# EAGLE design bord (EAGLE 8.5.2)
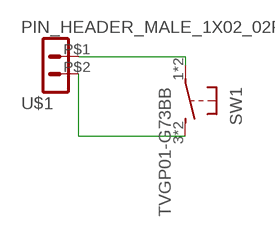
[diagram p0: schematic, sheet 1]

## Parts
SW1  TVGP01-G73BB  [TVGP01-G73BB]
U$1  PIN_HEADER_MALE_1X02_02P  [PIN_HEADER_MALE_1X02_02P]

## Nets
N$1: SW1.1 SW1.2 U$1.P$1
N$2: SW1.3 SW1.4 U$1.P$2

## Library data of the parts
SW1 = new:TVGP01-G73BB: http://akizukidenshi.com/download/ds/jianfu/TVGP01-G73BB.pdf
U$1 = 180118 Library by matsu:PIN_HEADER_MALE_1X02_02P

## Net classes
0 default: width 0.508 mm, clearance 0.254 mm

## Board
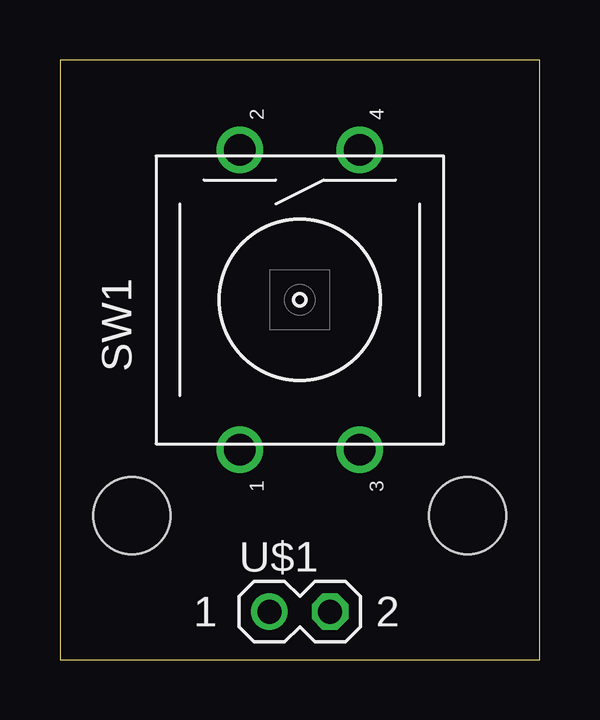
[diagram p1: board, top side]
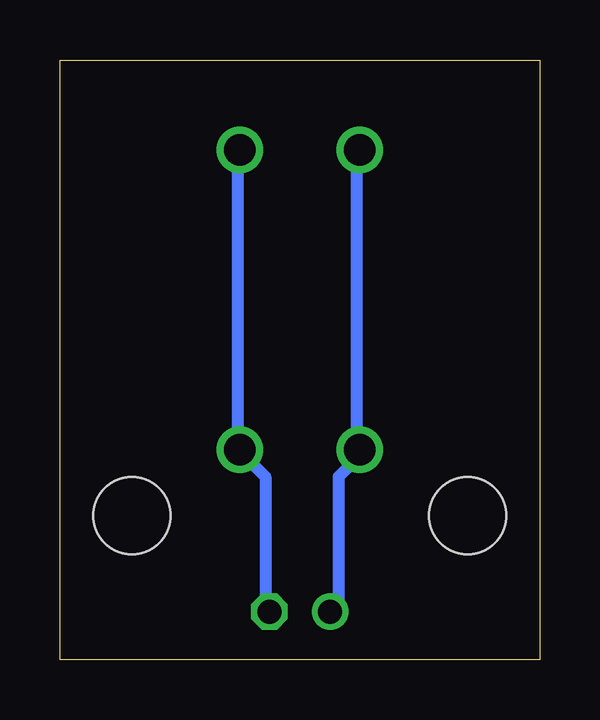
[diagram p2: board, bottom side, seen from below]

Size 20 x 25 mm. Coordinates in mm from the lower left corner, seen from the top.
Outline: 0,0 20,0 20,25 0,25 0,0
Copper layers (1*16): Top 0.035mm / dielectric 1.5mm / Bottom 0.035mm
Design rules "Elecrow_2-layer_eagle_rule": minimum track width 6mil, minimum drill 12mil, track to track 6mil, track to pad 6mil, pad to pad 6mil, via to via 6mil, smd to smd 0mil, copper to edge 10mil, drill to drill 10mil, minimum pad ring 10mil, minimum via ring 6mil, stop-mask expansion 2mil, vias tented up to drill 100mil, thermal gap 10mil
Holes 3.2 mm at 17,6 3,6

### Footprints (pad centres in the part's own frame; a part is rotated, then mirrored left to right if it is on the bottom)
TVGP01-G73BB = drill 1.3: 1 -6.25,2.5; 2 6.25,2.5; 3 -6.25,-2.5; 4 6.25,-2.5
PIN_HEADER_MALE_1X02_02P = drill 1: P$1 -1.27,0 | drill 1 octagon: P$2 1.27,0

### Placement (x,y rotation side)
SW1  10,15 90 top
U$1  10,2 0 top

### Tracks (layer width: path | path; a pad name or v marks a point on that pad's centre or on a via)
N$1
  Bottom 0.508: U$1.P$1 8.38,2.29 8.38,7.62 7.62,8.38 SW1.1 7.62,8.76 7.62,20.95 SW1.2
N$2
  Bottom 0.508: U$1.P$2 11.43,2.29 11.43,7.62 12.19,8.38 SW1.3 12.57,8.76 12.57,20.95 SW1.4